# EAGLE design PLT-02-RevA (EAGLE 9.6.2)
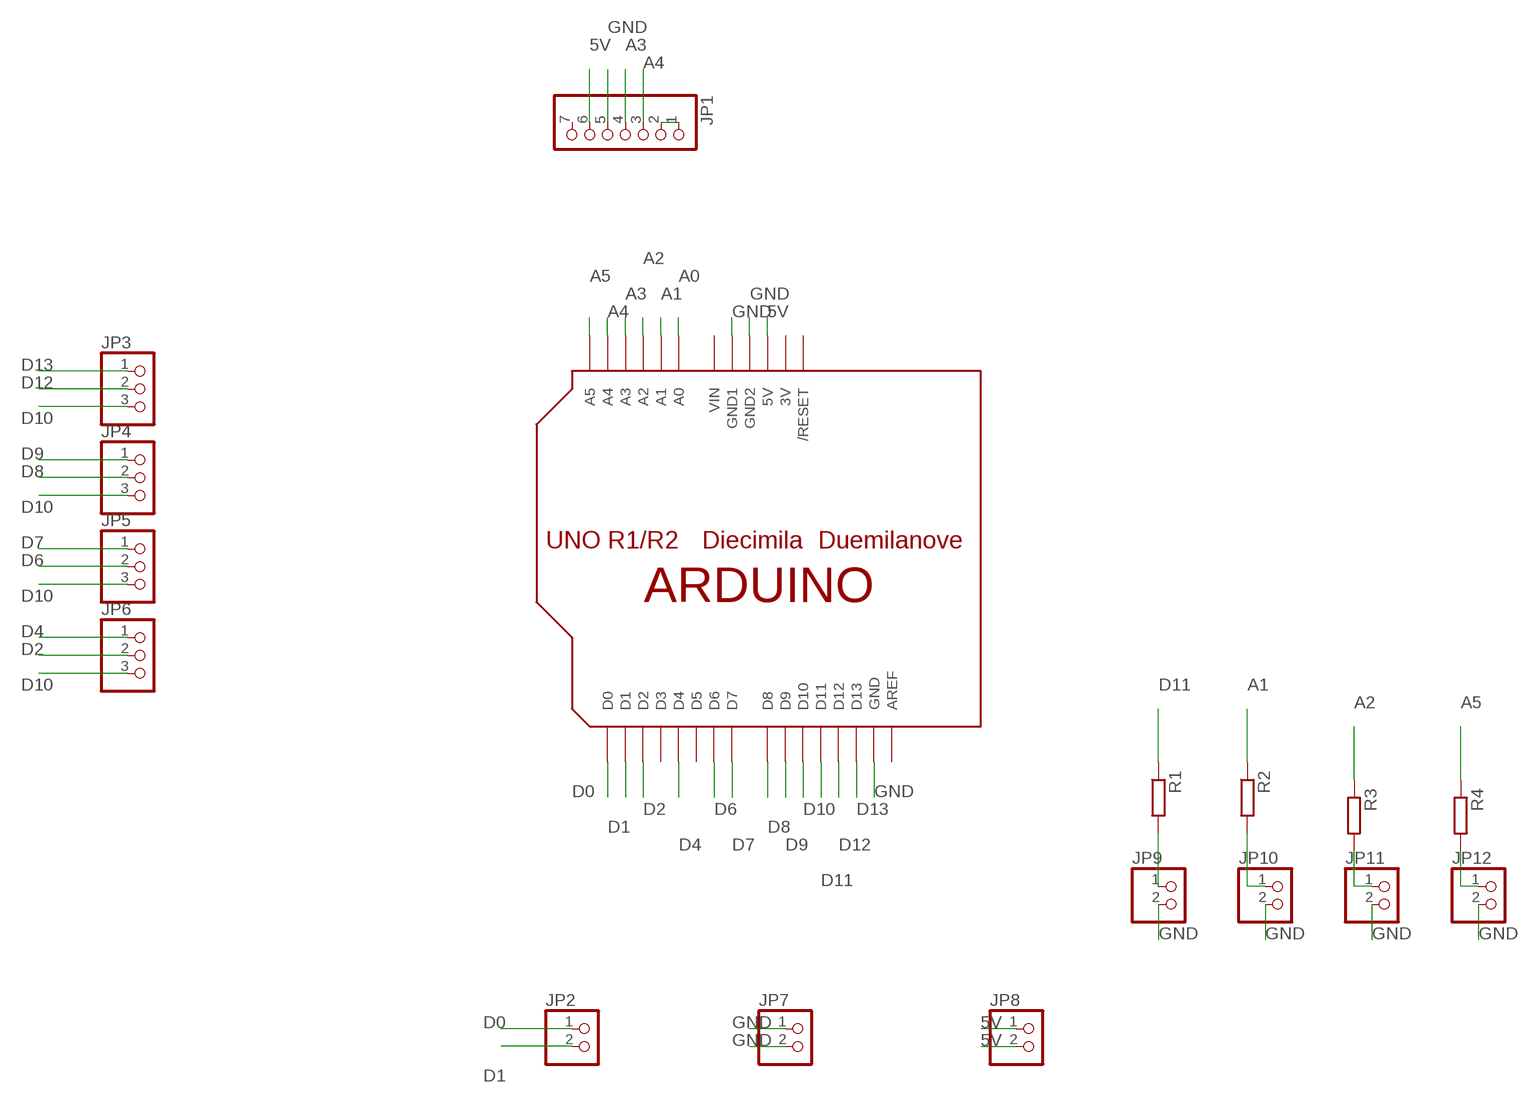
[diagram p0: schematic, sheet 1]

## Parts
JP1  PINHD-1X7  [1X07]
JP2  PINHD-1X2  [1X02]
JP3  PINHD-1X3  [1X03]
JP4  PINHD-1X3  [1X03]
JP5  PINHD-1X3  [1X03]
JP6  PINHD-1X3  [1X03]
JP7  PINHD-1X2  [1X02]
JP8  PINHD-1X2  [1X02]
JP9  PINHD-1X2  [1X02]
JP10  PINHD-1X2  [1X02]
JP11  PINHD-1X2  [1X02]
JP12  PINHD-1X2  [1X02]
R1  R-EU_0207/10  [0207/10]
R2  R-EU_0207/10  [0207/10]
R3  R-EU_0207/10  [0207/10]
R4  R-EU_0207/10  [0207/10]
U$1  ARDUINOUNO  [ARDUINO]

## Nets
5V: JP1.6 JP8.1 JP8.2 U$1.5V
A0: U$1.A0
A1: R2.1 U$1.A1
A2: R3.1 U$1.A2
A3: JP1.4 U$1.A3
A4: JP1.3 U$1.A4
A5: R4.1 U$1.A5
D0: JP2.1 U$1.D0
D1: JP2.2 U$1.D1
D2: JP6.2 U$1.D2
D4: JP6.1 U$1.D4
D6: JP5.2 U$1.D6
D7: JP5.1 U$1.D7
D8: JP4.2 U$1.D8
D9: JP4.1 U$1.D9
D10: JP3.3 JP4.3 JP5.3 JP6.3 U$1.D10
D11: R1.1 U$1.D11
D12: JP3.2 U$1.D12
D13: JP3.1 U$1.D13
GND: JP1.5 JP7.1 JP7.2 JP9.2 JP10.2 JP11.2 JP12.2 U$1.GND U$1.GND1 U$1.GND2
N$1: JP12.1 R4.2
N$2: JP10.1 R2.2
N$3: JP11.1 R3.2
N$6: JP1.1 JP1.2
N$12: JP9.1 R1.2
Unconnected: JP1.7 U$1.AREF U$1.D3 U$1.D5 U$1.RESET(/RESET)

## Power pins joined to a net without a drawn wire
3V: U$1.3V
VIN: U$1.VIN

## Library data of the parts
JP1 = pinhead:PINHD-1X7: PIN HEADER
JP2 JP7-JP12 = pinhead:PINHD-1X2: PIN HEADER
JP3-JP6 = pinhead:PINHD-1X3: PIN HEADER
R1-R4 = resistor:R-EU_: RESISTOR, European symbol
U$1 = adafruit:ARDUINO: Arduino Diecimila/Duemilanove Make a shield with ease, this package has all the named pins as well as the two mounting drill holes and an outline of the USB and DC power connector. The outline is on the DIMENSION layer, so if your board house uses it they will cut the outline to match. http://www.ladyada.net/library/pcb/eaglelibrary.html

## Board
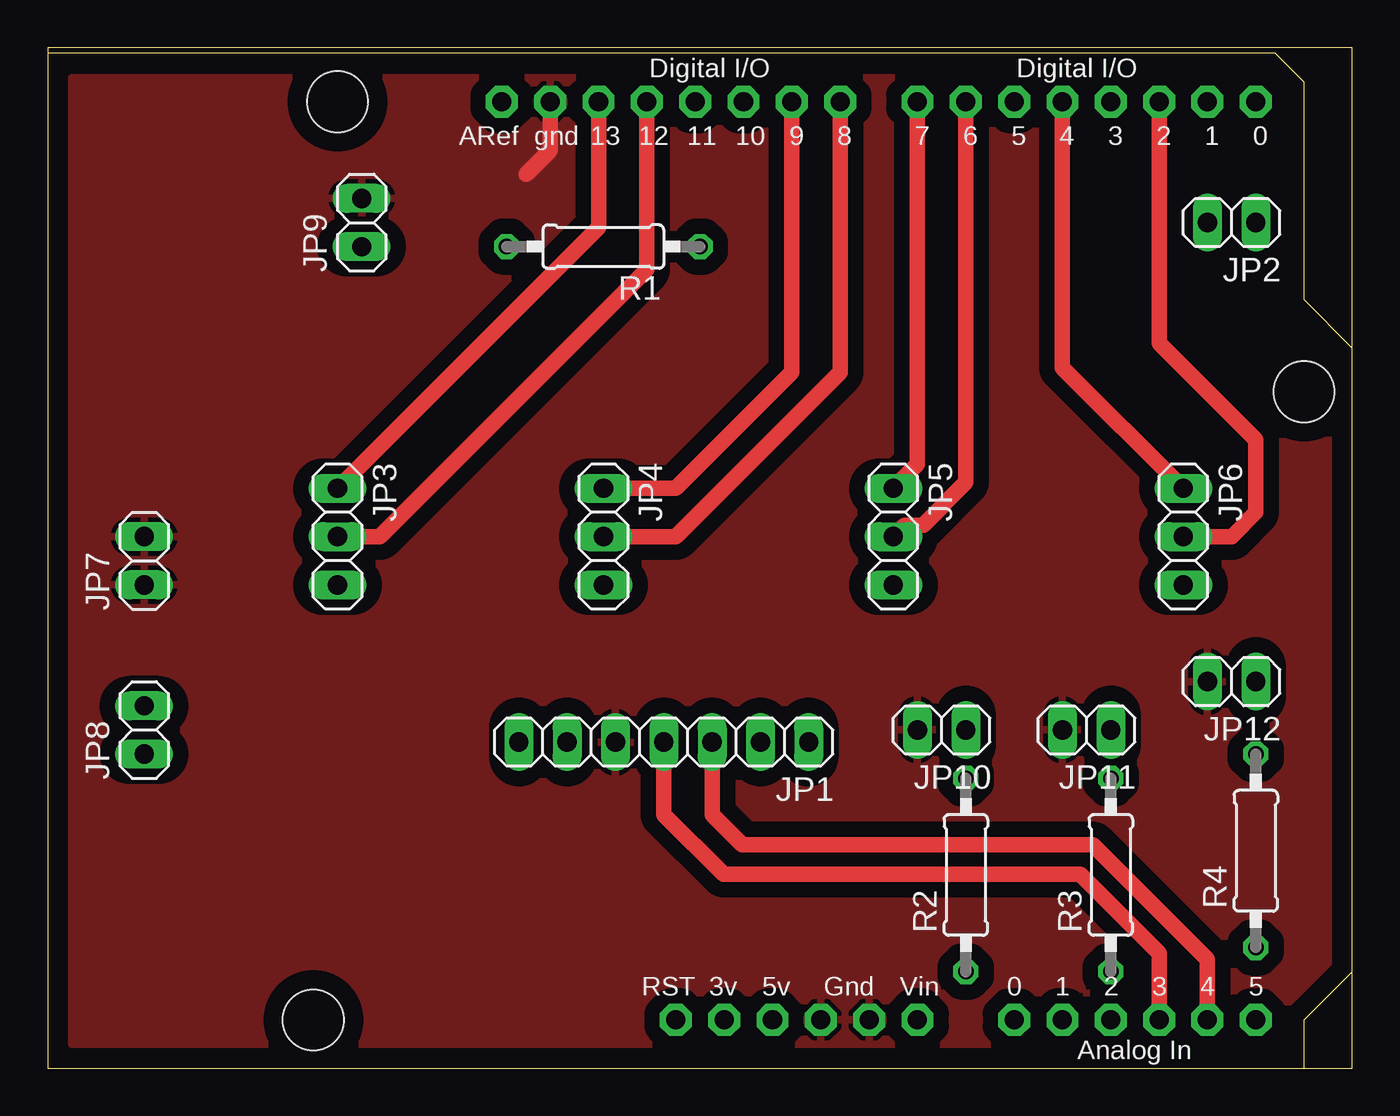
[diagram p1: board, top side]
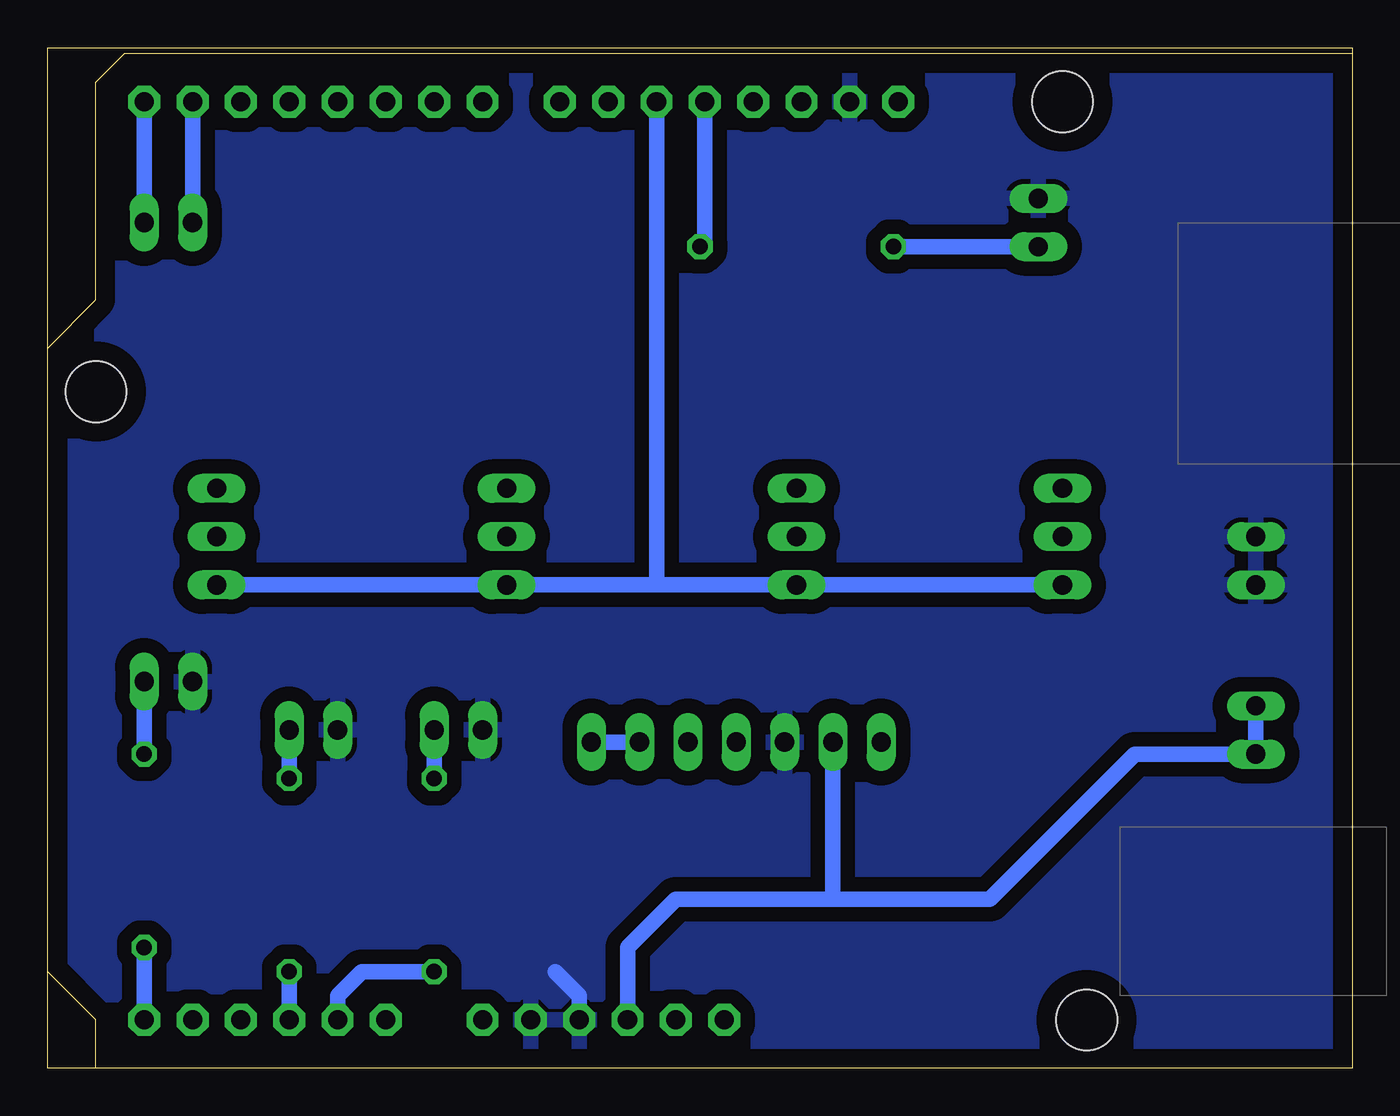
[diagram p2: board, bottom side, seen from below]

Size 68.58 x 53.64 mm. Coordinates in mm from the lower left corner, seen from the top.
Outline: 0,0 68.56,0 68.56,53.64 0,53.64 0,0
Copper layers (1*16): Top 0.035mm / dielectric 1.5mm / Bottom 0.035mm
Design rules "default *": minimum track width 10mil, minimum drill 24mil, track to track 30mil, track to pad 30mil, pad to pad 30mil, via to via 30mil, smd to smd 30mil, copper to edge 40mil, drill to drill 8mil, minimum pad ring 10mil, minimum via ring 8mil, stop-mask expansion 4mil, vias tented up to drill 0mil, thermal gap 10mil

### Footprints (pad centres in the part's own frame; a part is rotated, then mirrored left to right if it is on the bottom)
1X07 = drill 1.016 long: 1 -7.62,0; 2 -5.08,0; 3 -2.54,0; 4 0,0; 5 2.54,0; 6 5.08,0; 7 7.62,0
1X02 = drill 1.016 long: 1 -1.27,0; 2 1.27,0
1X03 = drill 1.016 long: 1 -2.54,0; 2 0,0; 3 2.54,0
0207/10 = drill 0.813 octagon: 1 -5.08,0; 2 5.08,0
ARDUINO = drill 1 pad 1.676 octagon: 3V 35.56,2.54; 5V 38.1,2.54; A0 50.8,2.54; A1 53.34,2.54; A2 55.88,2.54; A3 58.42,2.54; A4 60.96,2.54; A5 63.5,2.54; AREF 23.876,50.8; D0 63.5,50.8; D1 60.96,50.8; D2 58.42,50.8; D3 55.88,50.8; D4 53.34,50.8; D5 50.8,50.8; D6 48.26,50.8; D7 45.72,50.8; D8 41.656,50.8; D9 39.116,50.8; D10 36.576,50.8; D11 34.036,50.8; D12 31.496,50.8; D13 28.956,50.8; GND 26.416,50.8; GND1 43.18,2.54; GND2 40.64,2.54; RESET 33.02,2.54; VIN 45.72,2.54 | hole 3.2: 15.24,50.8; 66.04,35.56; 13.97,2.54

### Placement (x,y rotation side)
JP1  32.38,17.14 180 top
JP2  62.23,44.45 180 top
JP3  15.24,27.94 270 top
JP4  29.21,27.94 270 top
JP5  44.45,27.94 270 top
JP6  59.69,27.94 270 top
JP7  5.08,26.67 90 top
JP8  5.08,17.78 90 top
JP9  16.51,44.45 90 top
JP10  46.99,17.78 180 top
JP11  54.61,17.78 180 top
JP12  62.23,20.32 180 top
R1  29.21,43.18 180 top
R2  48.26,10.16 90 top
R3  55.88,10.16 90 top
R4  63.5,11.43 90 top
U$1  0,0 0 top

### Tracks (layer width: path | path; a pad name or v marks a point on that pad's centre or on a via)
5V
  Bottom 0.813: U$1.5V 38.1,6.35 35.56,8.89 27.3,8.89 | 27.3,8.89 19.05,8.89 11.43,16.51 JP8.1 JP8.2 | JP1.6 27.3,8.89
A1
  Bottom 0.813: U$1.A1 53.34,3.81 52.07,5.08 R2.1
A2
  Bottom 0.813: U$1.A2 R3.1
A3
  Top 0.813: JP1.4 32.38,13.33 35.53,10.18 54.27,10.18 58.42,6.04 U$1.A3
A4
  Top 0.813: U$1.A4 60.96,5.72 54.92,11.76 36.5,11.76 34.92,13.33 JP1.3
A5
  Bottom 0.813: U$1.A5 R4.1
D0
  Bottom 0.813: U$1.D0 JP2.1
D1
  Bottom 0.813: U$1.D1 JP2.2
D2
  Top 0.813: JP6.2 62.23,27.94 63.5,29.21 63.5,33.02 58.42,38.1 U$1.D2
D4
  Top 0.813: JP6.1 53.34,36.83 U$1.D4
D6
  Top 0.813: JP5.2 45.06,28.55 46.01,28.55 48.26,30.8 U$1.D6
D7
  Top 0.813: JP5.1 45.72,31.75 U$1.D7
D8
  Top 0.813: JP4.2 33.02,27.94 41.66,36.58 U$1.D8
D9
  Top 0.813: JP4.1 33.02,30.48 39.12,36.58 U$1.D9
D10
  Bottom 0.813: 36.58,25.4 JP4.3 JP3.3 | 36.58,25.4 JP5.3 JP6.3 | U$1.D10 36.58,25.4
D11
  Bottom 0.813: R1.1 34.04,43.43 U$1.D11
D12
  Top 0.813: U$1.D12 31.5,41.97 17.46,27.94 JP3.2
D13
  Top 0.813: JP3.1 28.96,44.2 U$1.D13
GND
  Top 0.813: U$1.GND 26.42,48.26 25.15,46.99
  Bottom 0.813: U$1.GND2 40.64,3.81 41.91,5.08
  pour Top (isolate 0.813): 1.27,52.07 1.27,1.27 67.31,1.27 67.31,52.07
  pour Bottom (isolate 0.61): 1.27,52.07 1.27,5.08 1.27,1.27 67.31,1.27 67.31,52.07
N$1
  Bottom 0.813: R4.2 JP12.1
N$2
  Bottom 0.813: R2.2 JP10.1
N$3
  Bottom 0.813: R3.2 JP11.1
N$6
  Bottom 0.813: JP1.2 JP1.1
N$12
  Bottom 0.813: R1.2 JP9.1